# Altium schematic sheet T35_5_MIPI.SchDoc
size A4
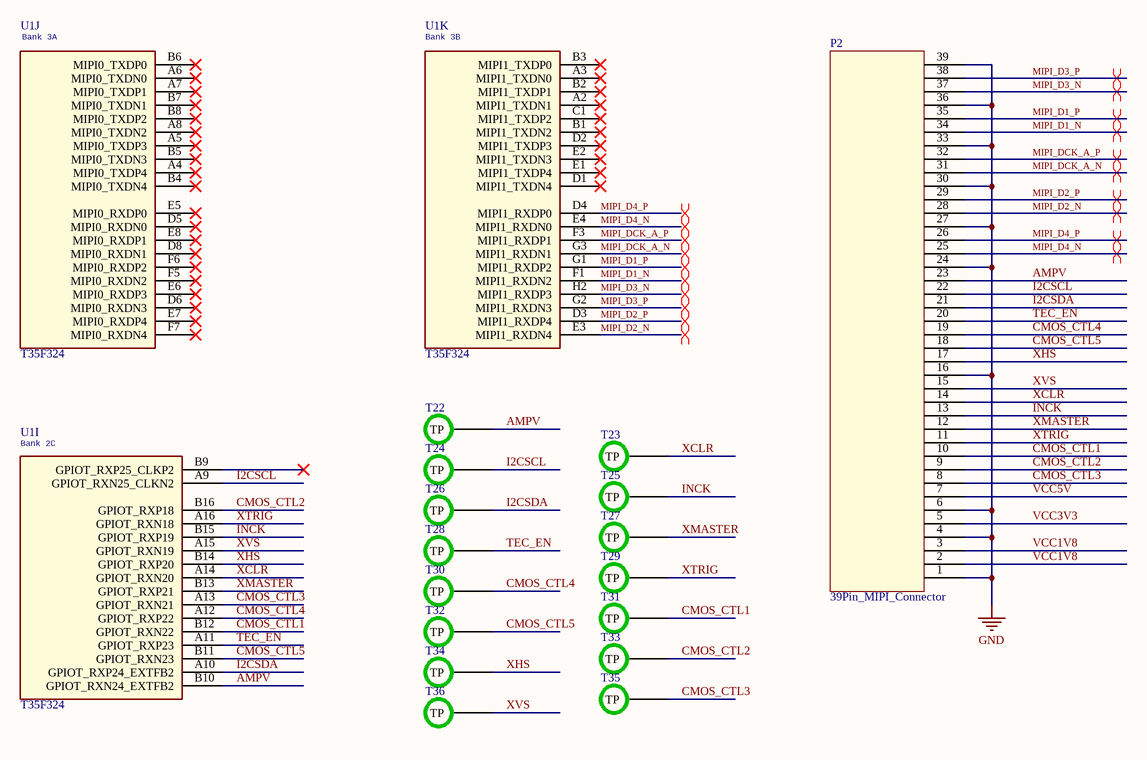
[diagram p0: T35_5_MIPI.SchDoc]

## Parts
P2  39Pin_MIPI_Connector  [39pin_0.3错位排序]
T22  (no value)  [TP-S]
T23  (no value)  [TP-S]
T24  (no value)  [TP-S]
T25  (no value)  [TP-S]
T26  (no value)  [TP-S]
T27  (no value)  [TP-S]
T28  (no value)  [TP-S]
T29  (no value)  [TP-S]
T30  (no value)  [TP-S]
T31  (no value)  [TP-S]
T32  (no value)  [TP-S]
T33  (no value)  [TP-S]
T34  (no value)  [TP-S]
T35  (no value)  [TP-S]
T36  (no value)  [TP-S]
U1  T35F324  [T35-F324-BGA100P9X9-81A]  (parts I,J,K of 17)

## Nets
GND: P2.1 P2.4 P2.6 P2.16 P2.24 P2.27 P2.30 P2.33 P2.36 P2.39
AMPV: P2.23 T22.1(TP) U1.B10(GPIOT_RXN24_EXTFB2)
CMOS_CTL1: P2.10 T31.1(TP) U1.B12(GPIOT_RXN22)
CMOS_CTL2: P2.9 T33.1(TP) U1.B16(GPIOT_RXP18)
CMOS_CTL3: P2.8 T35.1(TP) U1.A13(GPIOT_RXN21)
CMOS_CTL4: P2.19 T30.1(TP) U1.A12(GPIOT_RXP22)
CMOS_CTL5: P2.18 T32.1(TP) U1.B11(GPIOT_RXN23)
I2CSCL: P2.22 T24.1(TP) U1.A9(GPIOT_RXN25_CLKN2)
I2CSDA: P2.21 T26.1(TP) U1.A10(GPIOT_RXP24_EXTFB2)
INCK: P2.13 T25.1(TP) U1.B15(GPIOT_RXP19)
MIPI_D1_N: P2.34 U1.F1(MIPI1_RXDN2)
MIPI_D1_P: P2.35 U1.G1(MIPI1_RXDP2)
MIPI_D2_N: P2.28 U1.E3(MIPI1_RXDN4)
MIPI_D2_P: P2.29 U1.D3(MIPI1_RXDP4)
MIPI_D3_N: P2.37 U1.H2(MIPI1_RXDP3)
MIPI_D3_P: P2.38 U1.G2(MIPI1_RXDN3)
MIPI_D4_N: P2.25 U1.E4(MIPI1_RXDN0)
MIPI_D4_P: P2.26 U1.D4(MIPI1_RXDP0)
MIPI_DCK_A_N: P2.31 U1.G3(MIPI1_RXDN1)
MIPI_DCK_A_P: P2.32 U1.F3(MIPI1_RXDP1)
TEC_EN: P2.20 T28.1(TP) U1.A11(GPIOT_RXP23)
VCC1V8: P2.2 P2.3
VCC3V3: P2.5
VCC5V: P2.7
XCLR: P2.14 T23.1(TP) U1.A14(GPIOT_RXN20)
XHS: P2.17 T34.1(TP) U1.B14(GPIOT_RXP20)
XMASTER: P2.12 T27.1(TP) U1.B13(GPIOT_RXP21)
XTRIG: P2.11 T29.1(TP) U1.A16(GPIOT_RXN18)
XVS: P2.15 T36.1(TP) U1.A15(GPIOT_RXN19)

Not connected (* = marked no-connect by the designer): U1 A2(MIPI1_TXDN1)* A3(MIPI1_TXDN0)* A4(MIPI0_TXDP4)* A5(MIPI0_TXDP3)* A6(MIPI0_TXDN0)* A7(MIPI0_TXDP1)* A8(MIPI0_TXDN2)* B1(MIPI1_TXDN2)* B2(MIPI1_TXDP1)* B3(MIPI1_TXDP0)* B4(MIPI0_TXDN4)* B5(MIPI0_TXDN3)* B6(MIPI0_TXDP0)* B7(MIPI0_TXDN1)* B8(MIPI0_TXDP2)* B9(GPIOT_RXP25_CLKP2)* C1(MIPI1_TXDP2)* D1(MIPI1_TXDN4)* D2(MIPI1_TXDP3)* D5(MIPI0_RXDN0)* D6(MIPI0_RXDN3)* D8(MIPI0_RXDN1)* E1(MIPI1_TXDP4)* E2(MIPI1_TXDN3)* E5(MIPI0_RXDP0)* E6(MIPI0_RXDP3)* E7(MIPI0_RXDP4)* E8(MIPI0_RXDP1)* F5(MIPI0_RXDN2)* F6(MIPI0_RXDP2)* F7(MIPI0_RXDN4)*

## Layout directives
differential pair: MIPI_D1_N, MIPI_D1_P, MIPI_D2_N, MIPI_D2_P, MIPI_D3_N, MIPI_D3_P, MIPI_D4_N, MIPI_D4_P, MIPI_DCK_A_N, MIPI_DCK_A_P

## Notes on the sheet
- (in symbol T35F324, part I) Bank 2C
- (in symbol T35F324, part J) Bank 3A
- (in symbol T35F324, part K) Bank 3B

## Library data of the parts
P2 = 39Pin_MIPI_Connector: 0.3mm间距39PinFPC插座
T22-T36 = TP: 测试点
U1 = T35F324: FPGA芯片; SWAP_INFO: (S1+S2+S3+S4+S5+S6+S7+S8+S9+S10+S11+S12+S13+S14+S15+S16+S17); SPLIT_INST: TRUE